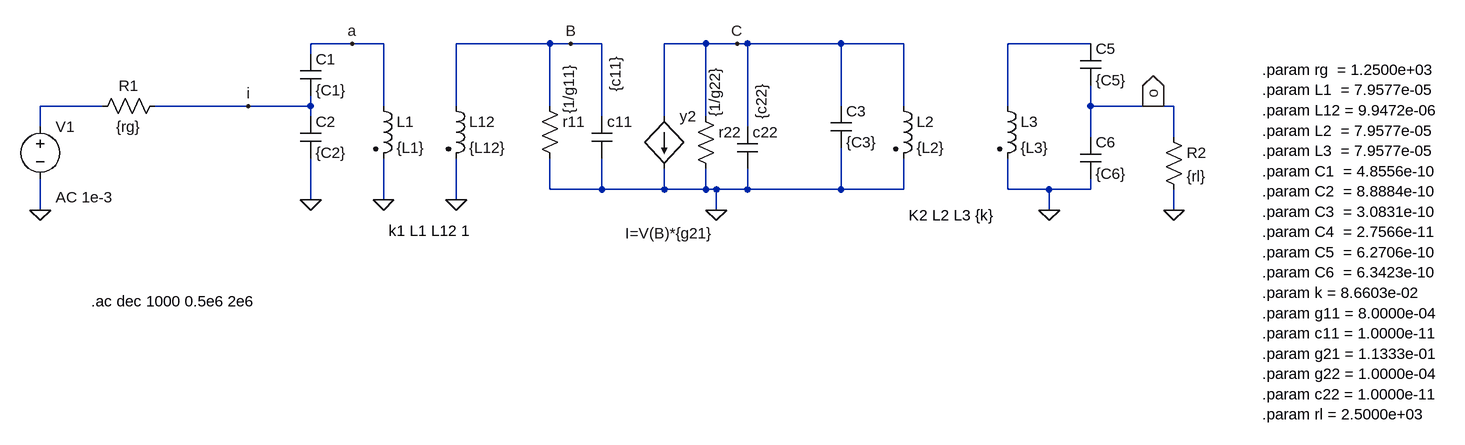
[diagram p0: schematic 20200803_RF.asc]
20200803_RF.asc, the LTspice schematic file:
Version 4
SHEET 1 1048 680
WIRE -800 32 -864 32
WIRE -752 32 -800 32
WIRE -496 32 -640 32
WIRE -464 32 -496 32
WIRE -416 32 -464 32
WIRE -256 32 -320 32
WIRE -208 32 -256 32
WIRE -192 32 -208 32
WIRE -48 32 -192 32
WIRE 48 32 -48 32
WIRE 336 32 208 32
WIRE -864 48 -864 32
WIRE -1184 128 -1280 128
WIRE -960 128 -1104 128
WIRE -864 128 -864 112
WIRE -864 128 -960 128
WIRE -752 128 -752 32
WIRE -640 128 -640 32
WIRE -496 128 -496 32
WIRE -48 128 -48 32
WIRE 48 128 48 32
WIRE 208 128 208 32
WIRE 336 128 336 96
WIRE 432 128 336 128
WIRE 464 128 432 128
WIRE -864 144 -864 128
WIRE -416 144 -416 32
WIRE -320 144 -320 32
WIRE -256 144 -256 32
WIRE -1280 160 -1280 128
WIRE -192 160 -192 32
WIRE 336 176 336 128
WIRE 464 176 464 128
WIRE -496 256 -496 208
WIRE -416 256 -416 208
WIRE -416 256 -496 256
WIRE -320 256 -320 224
WIRE -320 256 -416 256
WIRE -256 256 -256 224
WIRE -256 256 -320 256
WIRE -240 256 -256 256
WIRE -192 256 -192 224
WIRE -192 256 -240 256
WIRE -48 256 -48 192
WIRE -48 256 -192 256
WIRE 48 256 48 208
WIRE 48 256 -48 256
WIRE 208 256 208 208
WIRE 272 256 208 256
WIRE 336 256 336 240
WIRE 336 256 272 256
WIRE -864 272 -864 208
WIRE -752 272 -752 208
WIRE -640 272 -640 208
WIRE -1280 288 -1280 240
WIRE -240 288 -240 256
WIRE 272 288 272 256
WIRE 464 288 464 256
FLAG -752 272 0
FLAG -640 272 0
FLAG 272 288 0
FLAG -864 272 0
FLAG -240 288 0
FLAG -208 32 C
FLAG -464 32 B
FLAG 432 128 o
IOPIN 432 128 Out
FLAG 464 288 0
FLAG -1280 288 0
FLAG -960 128 i
FLAG -800 32 a
SYMBOL ind2 -768 112 R0
SYMATTR InstName L1
SYMATTR Value {L1}
SYMATTR Type ind
SYMBOL ind2 -656 112 R0
SYMATTR InstName L12
SYMATTR Value {L12}
SYMATTR Type ind
SYMBOL res -512 112 R0
WINDOW 3 45 28 VLeft 2
SYMATTR Value {1/g11}
SYMATTR InstName r11
SYMBOL cap -432 144 R0
WINDOW 3 37 -38 VLeft 2
SYMATTR Value {c11}
SYMATTR InstName c11
SYMBOL res -272 128 R0
WINDOW 3 30 17 VLeft 2
SYMATTR Value {1/g22}
SYMATTR InstName r22
SYMBOL cap -208 160 R0
WINDOW 3 37 -12 VLeft 2
SYMATTR Value {c22}
SYMATTR InstName c22
SYMATTR SpiceLine Rser=0
SYMBOL bi -320 144 R0
WINDOW 3 -60 180 Left 2
SYMATTR Value I=V(B)*{g21}
SYMATTR InstName y2
SYMBOL ind2 192 112 R0
SYMATTR InstName L3
SYMATTR Value {L3}
SYMATTR Type ind
SYMBOL cap 320 32 R0
SYMATTR InstName C5
SYMATTR Value {C5}
SYMBOL cap 320 176 R0
SYMATTR InstName C6
SYMATTR Value {C6}
SYMBOL cap -64 128 R0
SYMATTR InstName C3
SYMATTR Value {C3}
SYMBOL cap -880 144 R0
SYMATTR InstName C2
SYMATTR Value {C2}
SYMBOL res -1200 144 R270
WINDOW 0 32 56 VTop 2
WINDOW 3 0 56 VBottom 2
SYMATTR InstName R1
SYMATTR Value {rg}
SYMBOL res 448 160 R0
SYMATTR InstName R2
SYMATTR Value {rl}
SYMBOL ind2 32 112 R0
SYMATTR InstName L2
SYMATTR Value {L2}
SYMATTR Type ind
SYMBOL cap -880 48 R0
SYMATTR InstName C1
SYMATTR Value {C1}
SYMBOL voltage -1280 144 R0
WINDOW 123 24 124 Left 2
WINDOW 39 0 0 Left 0
SYMATTR InstName V1
SYMATTR Value ""
SYMATTR Value2 AC 1e-3
TEXT -744 320 Left 2 !k1 L1 L12 1
TEXT -1202 428 Left 2 !.ac dec 1000 0.5e6 2e6
TEXT 56 296 Left 2 !K2 L2 L3 {k}
TEXT 600 72 Left 2 !.param rg  = 1.2500e+03 \n.param L1  = 7.9577e-05 \n.param L12 = 9.9472e-06 \n.param L2  = 7.9577e-05 \n.param L3  = 7.9577e-05 \n.param C1  = 4.8556e-10 \n.param C2  = 8.8884e-10 \n.param C3  = 3.0831e-10 \n.param C4  = 2.7566e-11 \n.param C5  = 6.2706e-10 \n.param C6  = 6.3423e-10 \n.param k = 8.6603e-02 \n.param g11 = 8.0000e-04 \n.param c11 = 1.0000e-11 \n.param g21 = 1.1333e-01 \n.param g22 = 1.0000e-04 \n.param c22 = 1.0000e-11 \n.param rl = 2.5000e+03

The netlist it stands for:
* 20200803_RF.asc
L1 a 0 {L1}
L12 B 0 {L12}
r11 B 0 {1/g11}
c11 B 0 {c11}
r22 C 0 {1/g22}
c22 C 0 {c22} Rser=0
B§y2 C 0 I=V(B)*{g21}
L3 N001 0 {L3}
C5 N001 o {C5}
C6 o 0 {C6}
C3 C 0 {C3}
C2 i 0 {C2}
R1 N002 i {rg}
R2 o 0 {rl}
L2 C 0 {L2}
C1 a i {C1}
V1 N002 0 AC 1e-3
k1 L1 L12 1
.ac dec 1000 0.5e6 2e6
K2 L2 L3 {k}
.param rg  = 1.2500e+03
.param L1  = 7.9577e-05
.param L12 = 9.9472e-06
.param L2  = 7.9577e-05
.param L3  = 7.9577e-05
.param C1  = 4.8556e-10
.param C2  = 8.8884e-10
.param C3  = 3.0831e-10
.param C4  = 2.7566e-11
.param C5  = 6.2706e-10
.param C6  = 6.3423e-10
.param k = 8.6603e-02
.param g11 = 8.0000e-04
.param c11 = 1.0000e-11
.param g21 = 1.1333e-01
.param g22 = 1.0000e-04
.param c22 = 1.0000e-11
.param rl = 2.5000e+03
.backanno
.end